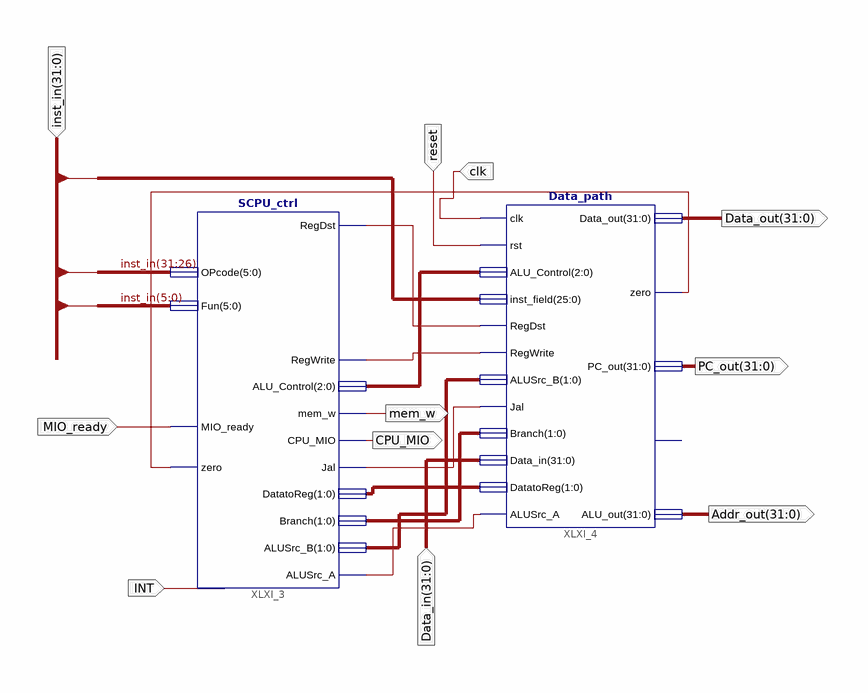
[diagram p0: schematic sheet 1]
// Xilinx ISE schematic SCPU.sch (kintex7) as structural Verilog: 2 symbols, 11 ports
module SCPU (
  input  [31:0] inst_in,
  input  MIO_ready,
  input  INT,
  input  [31:0] Data_in,
  input  clk,
  input  reset,
  output mem_w,
  output CPU_MIO,
  output [31:0] Addr_out,
  output [31:0] Data_out,
  output [31:0] PC_out
);

  wire XLXN_60, XLXN_63, XLXN_75, XLXN_76, XLXN_79;
  wire [1:0] XLXN_64, XLXN_71, XLXN_78;
  wire [2:0] XLXN_74;

  SCPU_ctrl XLXI_3 (
    .MIO_ready(MIO_ready), .zero(XLXN_60), .OPcode(inst_in[31:26]), .Fun(inst_in[5:0]), .Jal(XLXN_63),
    .RegDst(XLXN_76), .RegWrite(XLXN_75), .mem_w(mem_w), .CPU_MIO(CPU_MIO), .ALUSrc_B(XLXN_78),
    .DatatoReg(XLXN_64), .Branch(XLXN_71), .ALU_Control(XLXN_74), .ALUSrc_A(XLXN_79));
  Data_path XLXI_4 (
    .clk(clk), .rst(reset), .ALU_Control(XLXN_74), .inst_field(inst_in[25:0]), .RegDst(XLXN_76),
    .RegWrite(XLXN_75), .ALUSrc_B(XLXN_78), .Jal(XLXN_63), .Branch(XLXN_71), .Data_in(Data_in),
    .DatatoReg(XLXN_64), .ALUSrc_A(XLXN_79), .Data_out(Data_out), .zero(XLXN_60), .PC_out(PC_out),
    .ALU_out(Addr_out));  // open: overflow
endmodule
